# EAGLE design Netzgereat (EAGLE 7.5.0)
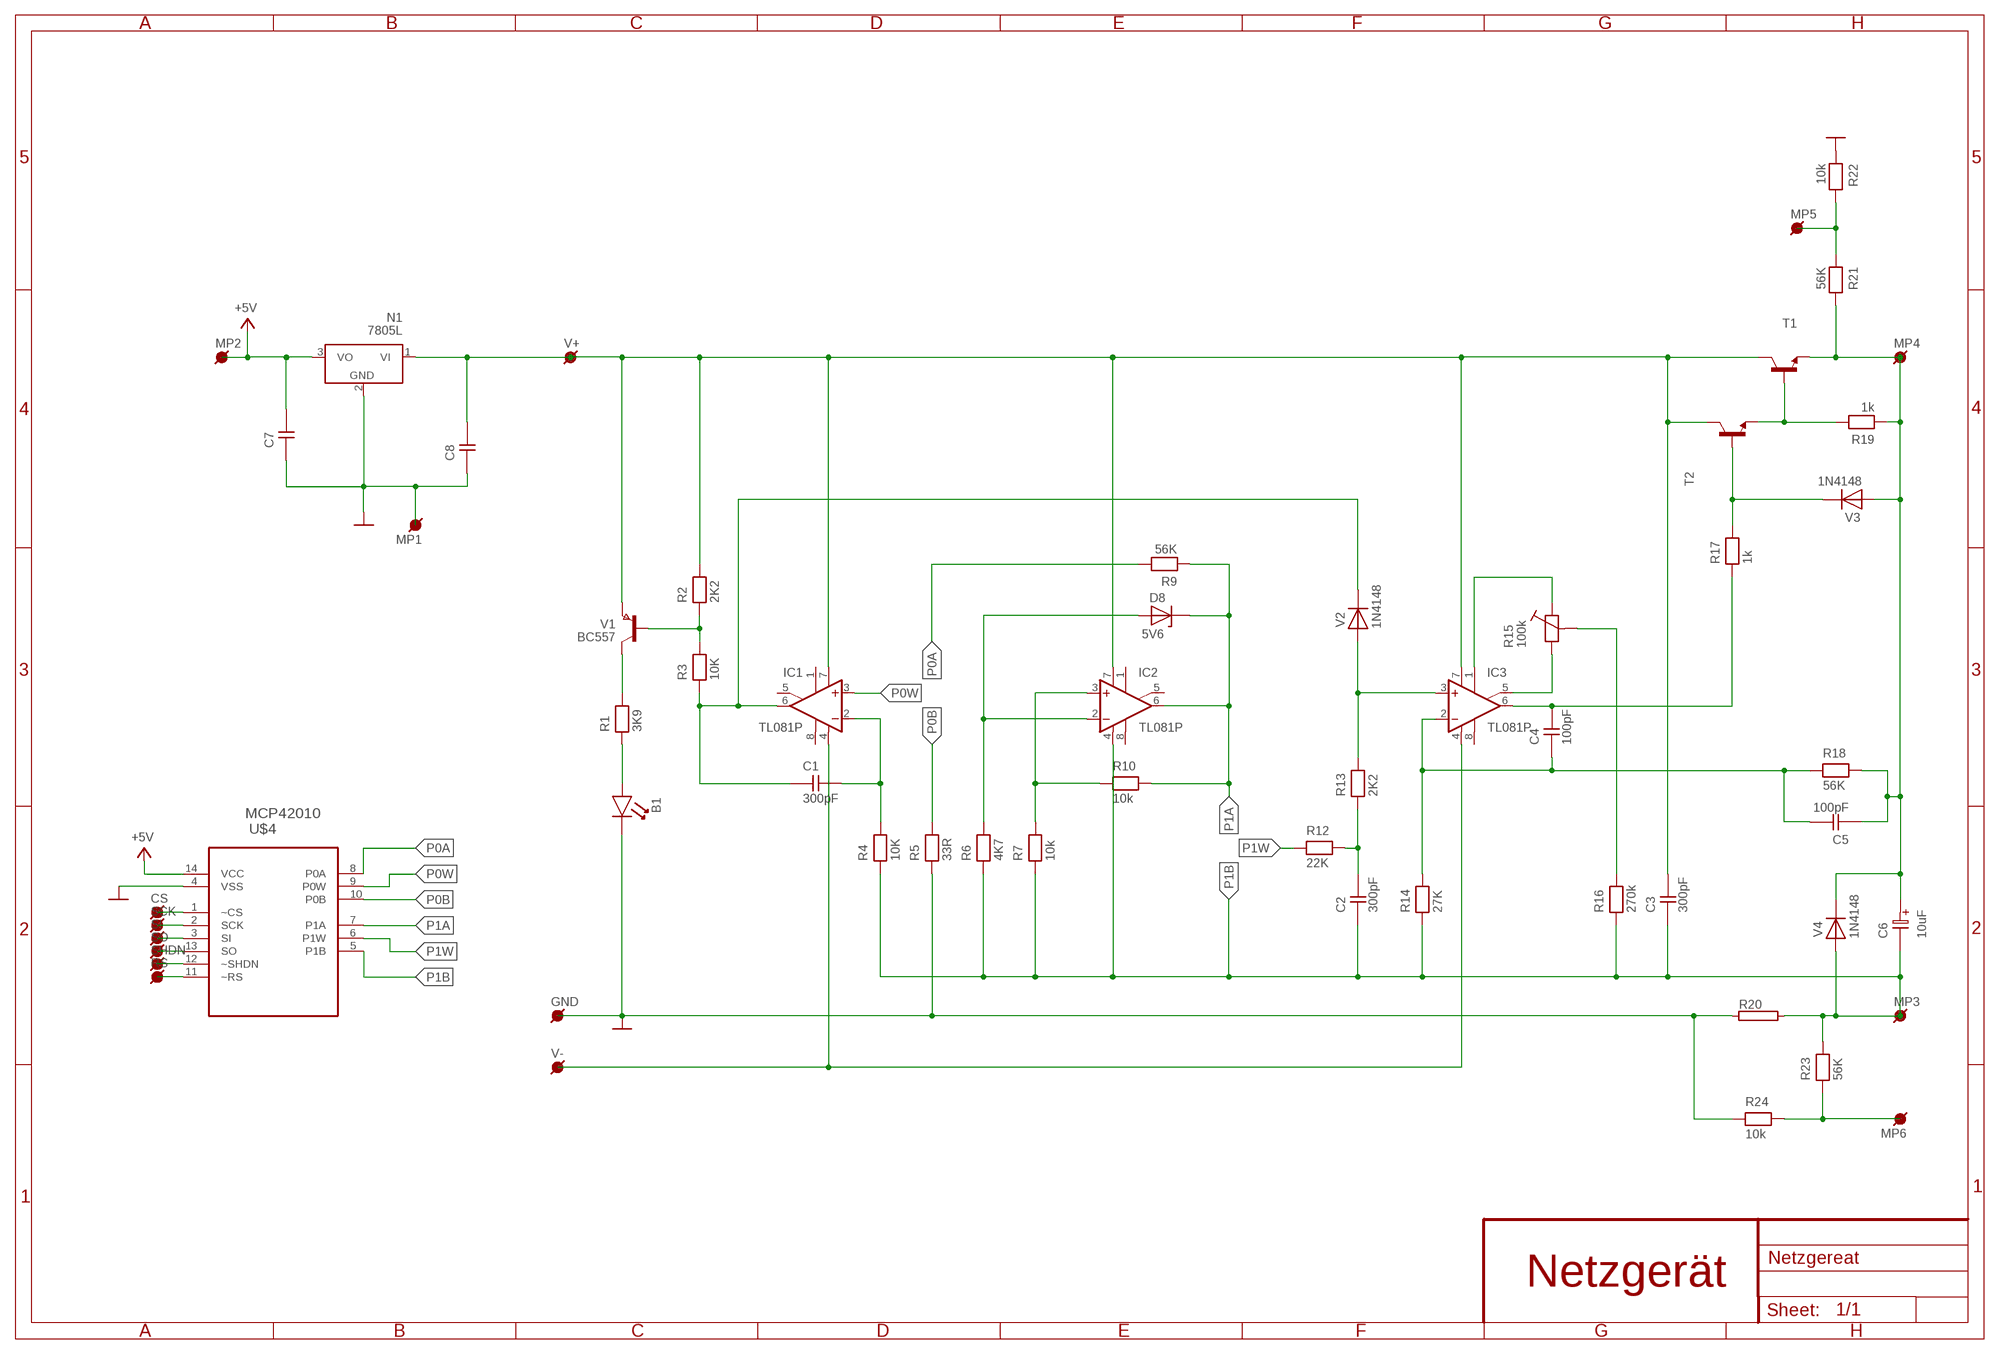
[diagram p0: schematic, sheet 1]

## Parts
B1  LED  [LED]
C1  300pF  C-5  [C-5]
C2  300pF  C-5  [C-5]
C3  300pF  C-5  [C-5]
C4  100pF  C-5  [C-5]
C5  100pF  C-5  [C-5]
C6  10uF  ELC-5  [ES-5]
C7  C-5  [C-5]
C8  C-5  [C-5]
CS  MP  [MP]
D8  5V6  ZD-7.5  [D-7,5]
GND  MP  [MP]
IC1  TL081P  [DIL08]
IC2  TL081P  [DIL08]
IC3  TL081P  [DIL08]
MP1  MP  [MP]
MP2  MP  [MP]
MP3  MP  [MP]
MP4  MP  [MP]
MP5  MP  [MP]
MP6  MP  [MP]
N1  7805L  [T0-92C]
R1  3K9  R-10  [R-10]
R2  2K2  R-10  [R-10]
R3  10K  R-10  [R-10]
R4  10K  R-10  [R-10]
R5  33R  R-10  [R-10]
R6  4K7  R-10  [R-10]
R7  10k  R-10  [R-10]
R9  56K  R-10  [R-10]
R10  10k  R-10  [R-10]
R12  22K  R-10  [R-10]
R13  2K2  R-10  [R-10]
R14  27K  R-10  [R-10]
R15  100k  R-TRIM-SPINDEL  [PT-SPIN]
R16  270k  R-10  [R-10]
R17  1k  R-10  [R-10]
R18  56K  R-10  [R-10]
R19  1k  R-10  [R-10]
R20  RKH208-8  [KH208-8]
R21  56K  R-10  [R-10]
R22  10k  R-10  [R-10]
R23  56K  R-10  [R-10]
R24  10k  R-10  [R-10]
RS  MP  [MP]
SCK  MP  [MP]
SHDN  MP  [MP]
SI  MP  [MP]
SO  MP  [MP]
T1  -NPN-TOP3V  [TOP3V]
T2  -NPN-TO126V  [TO126V]
U$4  MCP42010  [MCP42010]
V1  BC557  [TO-92C]
V2  1N4148  D-5  [D-5]
V3  1N4148  D-7.5  [D-7,5]
V4  1N4148  D-5  [D-5]
V+  MP  [MP]
V-  MP  [MP]

## Nets
+5V: C7.2 MP2.P$1(MP) N1.3(VO) U$4.14(VCC)
GND: B1.2(K) C7.1 C8.1 GND.P$1(MP) MP1.P$1(MP) N1.2(GND) R5.1 R20.1 R22.1 R24.1 U$4.4(VSS)
N$1: B1.1(A) R1.1
N$2: R1.2 V1.3(C)
N$3: C1.1 IC1.6(OUT) R3.1 V2.2(K)
N$4: C3.2 C8.2 IC1.7(V+) IC2.7(V+) IC3.7(V+) N1.1(VI) R2.2 T1.C T2.2(C) V1.1(E) V+.P$1(MP)
N$5: R2.1 R3.2 V1.2(B)
N$7: C1.2 IC1.2(-IN) R4.2
N$8: IC1.4(V-) IC3.4(V-) V-.P$1(MP)
N$9: MP5.P$1(MP) R21.1 R22.2
N$10: IC2.3(+IN) R7.2 R10.1
N$11: D8.1(A) IC2.2(-IN) R6.2
N$12: CS.P$1(MP) U$4.1(~CS)
N$13: SCK.P$1(MP) U$4.2(SCK)
N$14: SI.P$1(MP) U$4.3(SI)
N$15: C2.2 R12.2 R13.1
N$16: IC3.3(+IN) R13.2 V2.1(A)
N$17: C4.1 C5.2 IC3.2(-IN) R14.2 R18.1
N$18: IC3.1(ON1) R15.3
N$19: IC3.5(ON2) R15.1
N$20: R15.2 R16.2
N$21: C4.2 IC3.6(OUT) R17.1
N$22: SO.P$1(MP) U$4.13(SO)
N$23: R17.2 T2.3(B) V3.2(K)
N$24: SHDN.P$1(MP) U$4.12(~SHDN)
N$25: C5.1 C6.1 MP4.P$1(MP) R18.2 R19.1 R21.2 T1.E V3.1(A) V4.2(K)
N$27: RS.P$1(MP) U$4.11(~RS)
N$28: R19.2 T1.B T2.1(E)
N$30: MP6.P$1(MP) R23.1 R24.2
P0A: R9.2 U$4.8(P0A)
P0B: R5.2 U$4.10(P0B)
P0W: IC1.3(+IN) U$4.9(P0W)
P1A: D8.2(K) IC2.6(OUT) R9.1 R10.2 U$4.7(P1A)
P1B: C2.1 C3.1 C6.2 IC2.4(V-) MP3.P$1(MP) R4.1 R6.1 R7.1 R14.1 R16.1 R20.2 R23.2 U$4.5(P1B) V4.1(A)
P1W: R12.1 U$4.6(P1W)
Unconnected: IC1.1(ON1) IC1.5(ON2) IC1.8(OPT) IC2.1(ON1) IC2.5(ON2) IC2.8(OPT) IC3.8(OPT)

## Notes on the sheet
- Netzgerät

## Library data of the parts
B1 = halbleiter:LED: LED
C1-C5 C7 C8 = rcl:C: CAPACITOR
C6 = rcl:ELC: ELEKTROLYTIC CAPACITOR
CS GND MP1-MP6 RS SCK SHDN SI SO V+ V- = connect:MP: LÖTSTIFT
D8 = halbleiter:ZD: Z-DIODE
IC1-IC3 = linear:TL081: OP AMP
N1 = linear:78*: Positive VOLTAGE REGULATOR
R1-R7 R9 R10 R12-R14 R16-R19 R21-R24 = rcl:R: RESISTOR
R15 = rcl:R-TRIM: Trimmer
R20 = resistor-power:R: Power Resitor; OC_FARNELL: unknown; OC_NEWARK: unknown
T1 T2 = transistor:*-NPN-: NPN Transistror BF959 corrected 2008.03.06
U$4 = ledMatrix:MCP42010
V1 = halbleiter:BC557: PNP TRANSISTOR
V2-V4 = halbleiter:D: DIODE

## Board
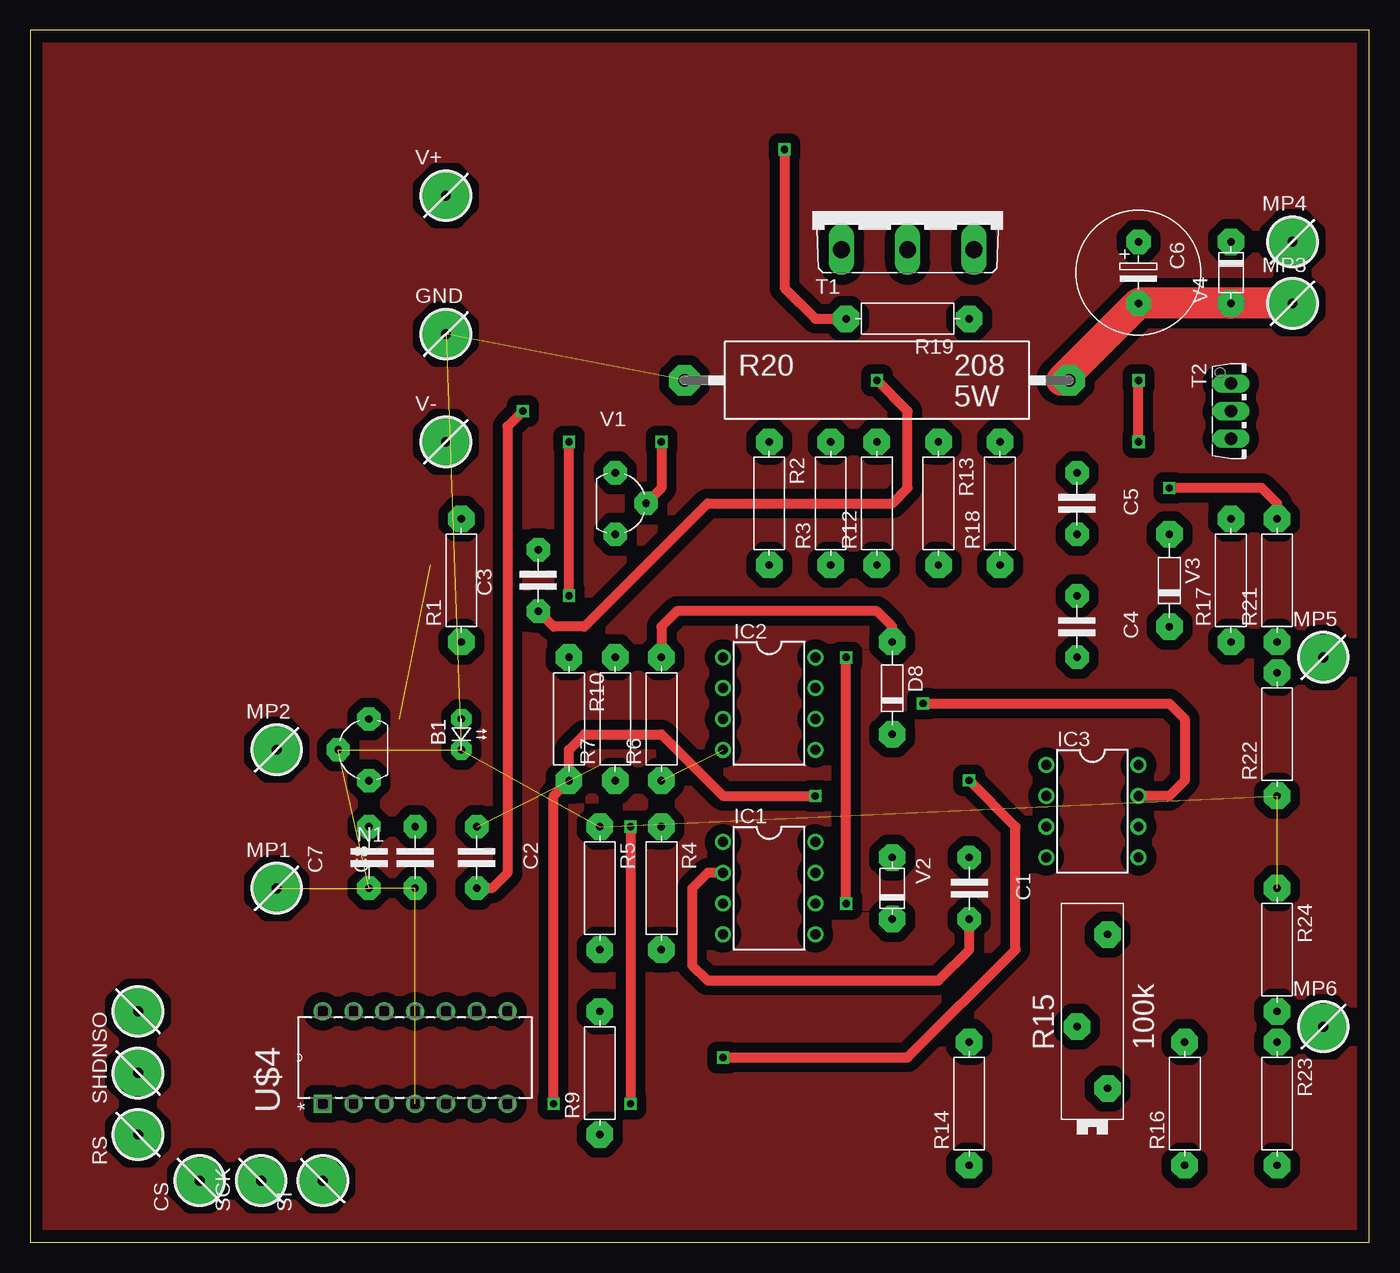
[diagram p1: board, top side]
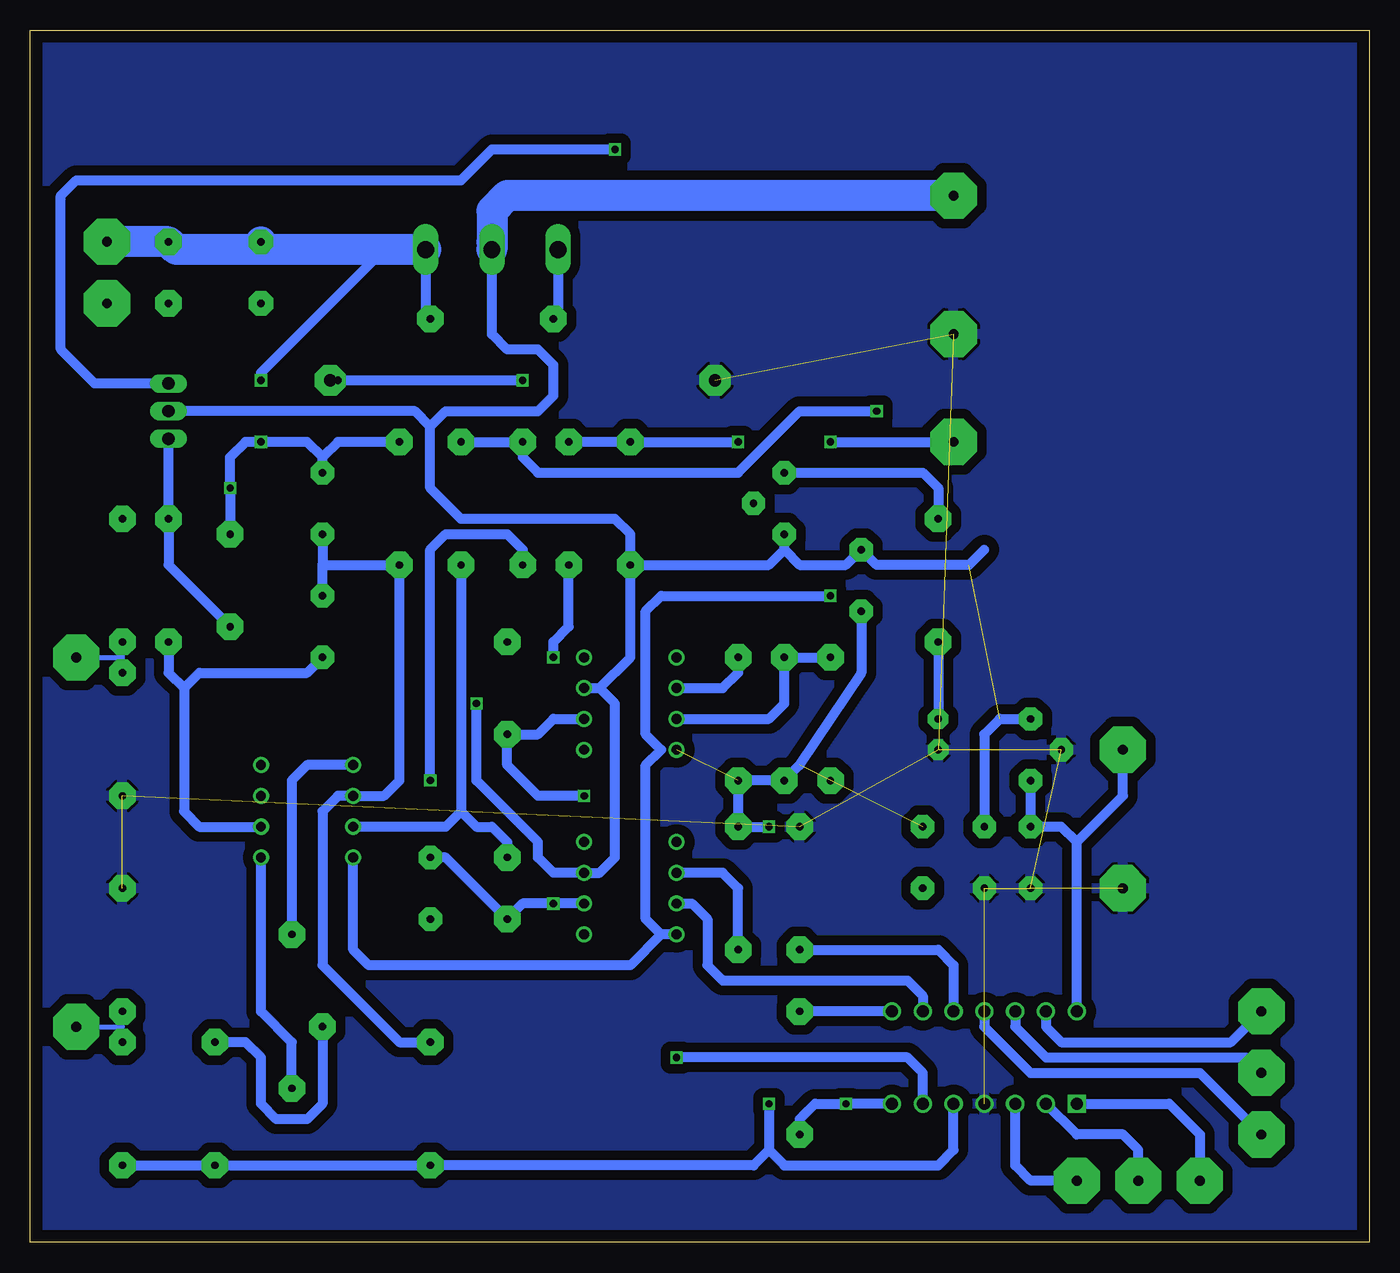
[diagram p2: board, bottom side, seen from below]

Size 110.47 x 100 mm. Coordinates in mm from the lower left corner, seen from the top.
Outline: 0,0 110.47,0 110.47,100 0,100 0,0
Copper layers (1*16): Top 0.035mm / dielectric 1.5mm / Bottom 0.035mm
Design rules "default": minimum track width 10mil, minimum drill 24mil, track to track 8mil, track to pad 8mil, pad to pad 8mil, via to via 8mil, smd to smd 8mil, copper to edge 40mil, drill to drill 8mil, minimum pad ring 10mil, minimum via ring 8mil, stop-mask expansion 4mil, vias tented up to drill 0mil, thermal gap 10mil

### Footprints (pad centres in the part's own frame; a part is rotated, then mirrored left to right if it is on the bottom)
LED = drill 0.61 pad 1.676 octagon: 1 -1.27,0; 2 1.27,0
C-5 = drill 0.61 pad 1.93 octagon: 1 -2.54,0; 2 2.54,0
ES-5 = drill 0.61 pad 2.007 octagon: 1 -2.54,0; 2 2.54,0
MP = drill 0.813 pad 3.81 octagon: P$1 0,0
D-7,5 = drill 0.61 pad 2.184 octagon: 1 -3.81,0; 2 3.81,0
DIL08 = drill 0.813 pad 1.27: 1 -3.81,-3.81; 2 -1.27,-3.81; 3 1.27,-3.81; 4 3.81,-3.81; 5 3.81,3.81; 6 1.27,3.81; 7 -1.27,3.81; 8 -3.81,3.81
T0-92C = drill 0.61 pad 1.93 octagon: 1 0,-2.54; 2 2.54,0; 3 0,2.54
R-10 = drill 0.61 pad 2.184 octagon: 1 -5.08,0; 2 5.08,0
PT-SPIN = drill 0.61 pad 2.184 octagon: 1 -6.35,-1.27; 2 -1.27,1.27; 3 6.35,-1.27
KH208-8 = drill 1.016 pad 2.54 octagon: 1 -15.875,0; 2 15.875,0
TOP3V = drill 1.397 long: B -5.461,-3.175; C 0,-3.175; E 5.461,-3.175
TO126V = drill 1.016 long: 1 -2.286,-1.27; 2 0,-1.27; 3 2.286,-1.27
MCP42010 = drill 0.991 square: 1 0,0 | drill 0.991: 2 0,-2.54; 3 0,-5.08; 4 0,-7.62; 5 0,-10.16; 6 0,-12.7; 7 0,-15.24; 8 7.62,-15.24; 9 7.62,-12.7; 10 7.62,-10.16; 11 7.62,-7.62; 12 7.62,-5.08; 13 7.62,-2.54; 14 7.62,0
TO-92C = drill 0.61 pad 1.93 octagon: 1 0,-2.54; 2 2.54,0; 3 0,2.54
D-5 = drill 0.61 pad 2.184 octagon: 1 -2.54,0; 2 2.54,0

### Placement (x,y rotation side)
B1  35.56,41.91 270 top
C1  77.47,29.21 270 top
C2  36.83,31.75 270 top
C3  41.91,54.61 90 top
C4  86.36,50.8 270 top
C5  86.36,60.96 270 top
C6  91.44,80.01 270 top
C7  27.94,31.75 90 top
C8  31.75,31.75 90 top
CS  13.97,5.08 90 top
D8  71.12,45.72 270 top
GND  34.29,74.93 0 top
IC1  60.96,29.21 270 top
IC2  60.96,44.45 270 top
IC3  87.63,35.56 270 top
MP1  20.32,29.21 0 top
MP2  20.32,40.64 0 top
MP3  104.14,77.47 0 top
MP4  104.14,82.55 0 top
MP5  106.68,48.26 0 top
MP6  106.68,17.78 0 top
N1  27.94,40.64 180 top
R1  35.56,54.61 90 top
R2  60.96,60.96 270 top
R3  66.04,60.96 90 top
R4  52.07,29.21 270 top
R5  46.99,29.21 270 top
R6  52.07,43.18 90 top
R7  48.26,43.18 90 top
R9  46.99,13.97 90 top
R10  44.45,43.18 270 top
R12  69.85,60.96 90 top
R13  74.93,60.96 270 top
R14  77.47,11.43 90 top
R15  87.63,19.05 90 top
R16  95.25,11.43 90 top
R17  99.06,54.61 90 top
R18  80.01,60.96 90 top
R19  72.39,76.2 180 top
R20  69.85,71.12 0 top
R21  102.87,54.61 90 top
R22  102.87,41.91 90 top
R23  102.87,11.43 270 top
R24  102.87,24.13 270 top
RS  8.89,8.89 90 top
SCK  19.05,5.08 90 top
SHDN  8.89,13.97 90 top
SI  24.13,5.08 90 top
SO  8.89,19.05 90 top
T1  72.39,85.09 0 top
T2  100.33,68.58 270 top
U$4  24.13,11.43 90 top
V1  48.26,60.96 0 top
V2  71.12,29.21 270 top
V3  93.98,54.61 270 top
V4  99.06,80.01 90 top
V+  34.29,86.36 0 top
V-  34.29,66.04 0 top

### Tracks (layer width: path | path; a pad name or v marks a point on that pad's centre or on a via)
+5V
  Bottom 0.813: N1.3 C7.2 25.4,34.29 24.13,33.02 | U$4.14 24.13,33.02 | 24.13,33.02 20.32,36.83 MP2.P$1
GND  (10 unrouted)
  pour Bottom (isolate 0.813): 0,100.33 0,0 110.49,0 110.49,100.33
N$1
  Bottom 0.813: R1.1 B1.1
N$2
  Bottom 0.813: V1.3 36.83,63.5 35.56,62.23 R1.2
N$3  (via drill 0.6)
  Top 0.813: v67.31,27.94 v67.31,48.26
  Bottom 0.813: IC1.6 v67.31,27.94 69.85,27.94 V2.2 76.2,31.75 C1.1 | v67.31,48.26 67.31,49.53 66.04,50.8 R3.1
N$4  (via drill 0.6)  (1 unrouted)
  Top 0.813: v73.66,44.45 93.98,44.45 95.25,43.18 95.25,38.1 93.98,36.83 IC3.7
  Bottom 0.813: N1.1 30.48,43.18 31.75,41.91 C8.2 | 63.5,45.72 62.23,44.45 62.23,31.75 63.5,30.48 IC1.7 67.31,30.48 68.58,31.75 68.58,33.02 73.66,38.1 v73.66,44.45 | IC2.7 63.5,45.72 | 63.5,45.72 60.96,48.26 R2.2 | R2.2 49.53,55.88 48.26,57.15 | 48.26,57.15 V1.1 | 48.26,57.15 46.99,55.88 43.18,55.88 C3.2 40.64,55.88 33.02,55.88 31.75,57.15 | R2.2 60.96,58.42 62.23,59.69 74.93,59.69 77.47,62.23 77.47,67.31 | 77.47,67.31 78.74,68.58 T2.2 | 77.47,67.31 76.2,68.58 68.58,68.58 67.31,69.85 67.31,72.39 68.58,73.66 71.12,73.66 72.39,74.93 72.39,82.55
  Bottom 2.54: V+.P$1 71.12,86.36 72.39,85.09 72.39,82.55 T1.C
N$5  (via drill 0.6)
  Top 0.813: v52.07,66.04 52.07,62.23 V1.2
  Bottom 0.813: R3.2 R2.1 v52.07,66.04
N$6
  pour Top (isolate 0.813): 0,100.33 110.49,100.33 110.49,0 0,0
N$7
  Top 0.813: IC1.2 55.88,30.48 54.61,29.21 54.61,22.86 55.88,21.59 74.93,21.59 77.47,24.13 C1.2
  Bottom 0.813: R4.2 52.07,29.21 53.34,30.48 IC1.2
N$8  (via drill 0.6)
  Top 0.813: v44.45,53.34 v44.45,66.04
  Bottom 0.813: 58.42,25.4 59.69,26.67 59.69,39.37 58.42,40.64 59.69,41.91 59.69,52.07 58.42,53.34 v44.45,53.34 | IC1.4 58.42,25.4 | 58.42,25.4 60.96,22.86 82.55,22.86 83.82,24.13 IC3.4 | v44.45,66.04 V-.P$1
N$9
  Bottom 0.406: R21.1 102.87,48.26 | 102.87,48.26 R22.2 | MP5.P$1 102.87,48.26
N$10
  Bottom 0.813: IC2.3 49.53,43.18 48.26,44.45 R7.2 R10.1
N$11
  Top 0.813: D8.1 71.12,50.8 69.85,52.07 53.34,52.07 52.07,50.8 R6.2
  Bottom 0.813: IC2.2 53.34,45.72 52.07,46.99 R6.2
N$12
  Bottom 0.813: U$4.1 16.51,11.43 13.97,8.89 CS.P$1
N$13
  Bottom 0.813: SCK.P$1 19.05,7.62 20.32,8.89 24.13,8.89 U$4.2
N$14
  Bottom 0.813: SI.P$1 27.94,5.08 29.21,6.35 U$4.3
N$15  (via drill 0.6)
  Top 0.813: v40.64,68.58 39.37,67.31 39.37,30.48 38.1,29.21 C2.2
  Bottom 0.813: R13.1 R12.2 69.85,64.77 68.58,63.5 52.07,63.5 46.99,68.58 v40.64,68.58
N$16
  Bottom 0.813: R13.2 74.93,35.56 | IC3.3 76.2,34.29 74.93,35.56 | 74.93,35.56 73.66,34.29 72.39,34.29 71.12,33.02 V2.1
N$17
  Bottom 0.813: C5.2 86.36,55.88 | 86.36,55.88 R18.1 80.01,38.1 81.28,36.83 IC3.2 85.09,36.83 86.36,35.56 86.36,22.86 80.01,16.51 R14.2 | C4.1 86.36,55.88
N$18
  Bottom 0.813: IC3.1 87.63,39.37 88.9,38.1 R15.3
N$19
  Bottom 0.813: R15.1 88.9,16.51 91.44,19.05 IC3.5
N$20
  Bottom 0.813: R15.2 86.36,11.43 87.63,10.16 90.17,10.16 91.44,11.43 91.44,15.24 92.71,16.51 R16.2
N$21
  Bottom 0.813: 97.79,45.72 97.79,35.56 96.52,34.29 IC3.6 | R17.1 99.06,46.99 97.79,45.72 | 97.79,45.72 96.52,46.99 87.63,46.99 C4.2
N$22
  Bottom 0.813: U$4.13 26.67,17.78 25.4,16.51 11.43,16.51 SO.P$1
N$23
  Bottom 0.813: T2.3 R17.2 99.06,55.88 V3.2
N$24
  Bottom 0.813: U$4.12 29.21,17.78 26.67,15.24 10.16,15.24 SHDN.P$1
N$25  (via drill 0.6)
  Top 0.813: v91.44,66.04 v91.44,71.12 | R21.2 102.87,60.96 101.6,62.23 v93.98,62.23
  Bottom 0.813: T1.E 77.85,76.58 R19.1 | R18.2 85.09,66.04 86.36,64.77 | C5.1 86.36,64.77 | 86.36,64.77 87.63,66.04 v91.44,66.04 92.71,66.04 93.98,64.77 v93.98,62.23 V3.1 | v91.44,71.12 91.44,71.75 81.28,81.92
  Bottom 2.54: T1.E 81.28,81.92 91.44,81.92 | 91.44,81.92 98.43,81.92 V4.2 MP4.P$1 | C6.1 91.44,81.92
N$27
  Bottom 0.813: U$4.11 31.75,17.78 27.94,13.97 13.97,13.97 RS.P$1
N$28  (via drill 0.6)
  Top 0.813: v62.23,90.17 62.23,78.74 64.77,76.2 R19.2
  Bottom 0.813: T1.B 66.93,76.58 R19.2 | T2.1 105.16,70.87 107.95,73.66 107.95,86.36 106.68,87.63 74.93,87.63 72.39,90.17 v62.23,90.17
N$30
  Bottom 0.406: MP6.P$1 102.87,17.78 | 102.87,17.78 R24.2 | R23.1 102.87,17.78
P0A
  Bottom 0.813: U$4.8 R9.2
P0B
  Bottom 0.813: R5.2 35.56,24.13 34.29,22.86 U$4.10
P0W
  Bottom 0.813: IC1.3 55.88,27.94 54.61,26.67 54.61,22.86 53.34,21.59 38.1,21.59 36.83,20.32 U$4.9
P1A  (via drill 0.6)
  Top 0.813: v43.18,11.43 43.18,36.83 R10.2 44.45,40.64 45.72,41.91 52.07,41.91 57.15,36.83 v64.77,36.83
  Bottom 0.813: IC2.6 67.31,43.18 68.58,41.91 D8.2 71.12,39.37 68.58,36.83 v64.77,36.83 | U$4.7 v43.18,11.43 45.72,11.43 46.99,10.16 R9.1
P1B  (via drill 0.6)  (2 unrouted)
  Top 0.813: v49.53,34.29 v49.53,11.43 | R20.2 v85.09,71.12 | C3.1 43.18,50.8 45.72,50.8 55.88,60.96 71.12,60.96 72.39,62.23 72.39,68.58 v69.85,71.12
  Top 2.54: MP3.P$1 V4.1 C6.2 v85.09,71.12
  Bottom 0.813: v49.53,34.29 R4.1 R6.1 R7.1 46.99,39.37 41.91,46.99 C3.1 | v49.53,11.43 49.53,7.62 | 49.53,7.62 48.26,6.35 35.56,6.35 34.29,7.62 U$4.5 | 49.53,7.62 50.8,6.35 R14.1 R16.1 R23.2 | v85.09,71.12 v69.85,71.12
P1W  (via drill 0.6)
  Top 0.813: v57.15,15.24 72.39,15.24 81.28,24.13 81.28,34.29 v77.47,38.1
  Bottom 0.813: U$4.6 36.83,13.97 38.1,15.24 v57.15,15.24 | v77.47,38.1 77.47,57.15 76.2,58.42 71.12,58.42 69.85,57.15 R12.1